# EAGLE design ChestStrapV2 (EAGLE 5.07)
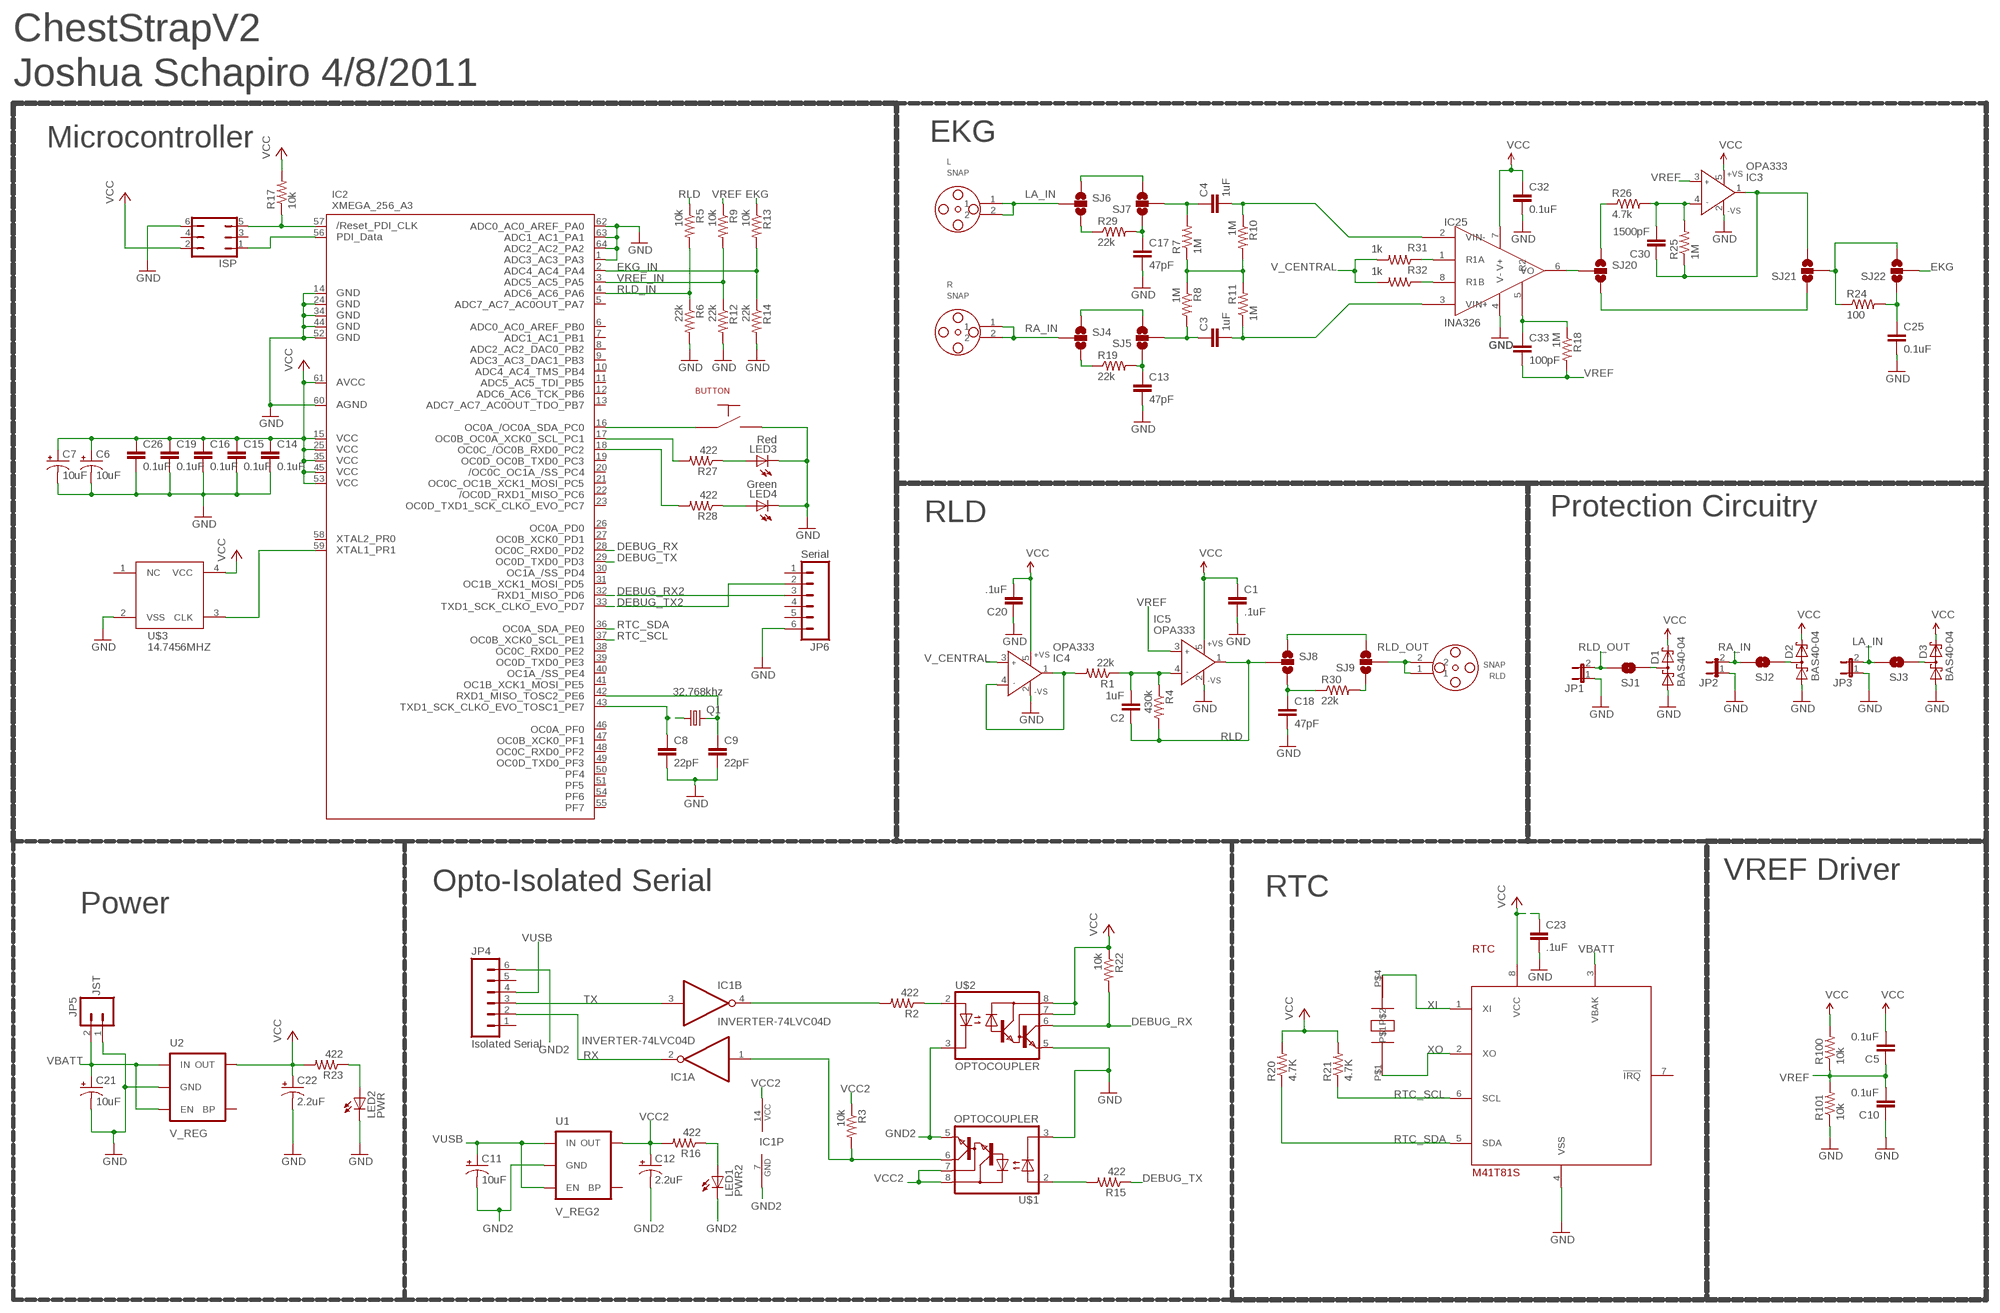
[diagram p0: schematic, sheet 1]

## Parts
BUTTON  BUTTON  [SMDBUTTON]
C1  .1uF  CAP0805  [0805]
C2  1uF  CAP0805  [0805]
C3  1uF  CAP0805  [0805]
C4  1uF  CAP0805  [0805]
C5  0.1uF  CAP0805  [0805]
C6  10uF  CAP_POL1206  [EIA3216]
C7  10uF  CAP_POL1206  [EIA3216]
C8  22pF  CAP0805  [0805]
C9  22pF  CAP0805  [0805]
C10  0.1uF  CAP0805  [0805]
C11  10uF  CAP_POL1206  [EIA3216]
C12  2.2uF  CAP_POL1206  [EIA3216]
C13  47pF  CAP0805  [0805]
C14  0.1uF  CAP0805  [0805]
C15  0.1uF  CAP0805  [0805]
C16  0.1uF  CAP0805  [0805]
C17  47pF  CAP0805  [0805]
C18  47pF  CAP0805  [0805]
C19  0.1uF  CAP0805  [0805]
C20  .1uF  CAP0805  [0805]
C21  10uF  CAP_POL1206  [EIA3216]
C22  2.2uF  CAP_POL1206  [EIA3216]
C23  .1uF  CAP0805  [0805]
C25  0.1uF  CAP0805  [0805]
C26  0.1uF  CAP0805  [0805]
C30  1500pF  CAP0805  [0805]
C32  0.1uF  CAP0805  [0805]
C33  100pF  CAP0805  [0805]
CRYSTAL  ECS_CRYSTAL  [ECS_CRYSTAL]
D1  BAS40-04  [SOT23]
D2  BAS40-04  [SOT23]
D3  BAS40-04  [SOT23]
IC1  INVERTER-74LVC04D  INVERTER-74ALS04D  [SO14]
IC2  XMEGA_256_A3  AVR_XMEGA_A3_  [TQFP64]
IC3  OPA333  AD8067  [SOT23-5]
IC4  OPA333  AD8067  [SOT23-5]
IC5  OPA333  AD8067  [SOT23-5]
IC25  INA326  [DGK_S-PDSO-G8]
ISP  JP3Q  [JP3Q]
JP1  JP1E  [JP1]
JP2  JP1E  [JP1]
JP3  JP1E  [JP1]
JP4  Isolated Serial  M06RA  [MOLEX-1X6-RA]
JP5  JST  M02JST-PTH-2  [JST-2-PTH]
JP6  Serial  M06RA  [MOLEX-1X6-RA]
L  SNAP  [SNAP]
LED1  PWR2  LEDCHIP-LED0805  [CHIP-LED0805]
LED2  PWR  LEDCHIP-LED0805  [CHIP-LED0805]
LED3  Red  LEDCHIP-LED0805  [CHIP-LED0805]
LED4  Green  LEDCHIP-LED0805  [CHIP-LED0805]
Q1  32.768khz  CRYSTAL32-SMD  [CRYSTAL-32KHZ-SMD]
R  SNAP  [SNAP]
R1  22k  RESISTOR  [0805]
R2  422  RESISTOR  [0805]
R3  10k  RESISTOR  [0805]
R4  430k  RESISTOR  [0805]
R5  10k  RESISTOR  [0805]
R6  22k  RESISTOR  [0805]
R7  1M  RESISTOR  [0805]
R8  1M  RESISTOR  [0805]
R9  10k  RESISTOR  [0805]
R10  1M  RESISTOR  [0805]
R11  1M  RESISTOR  [0805]
R12  22k  RESISTOR  [0805]
R13  10k  RESISTOR  [0805]
R14  22k  RESISTOR  [0805]
R15  422  RESISTOR  [0805]
R16  422  RESISTOR  [0805]
R17  10k  RESISTOR  [0805]
R18  1M  RESISTOR  [0805]
R19  22k  RESISTOR  [0805]
R20  4.7K  RESISTOR  [0805]
R21  4.7K  RESISTOR  [0805]
R22  10k  RESISTOR  [0805]
R23  422  RESISTOR  [0805]
R24  100  RESISTOR  [0805]
R25  1M  RESISTOR  [0805]
R26  4.7k  RESISTOR  [0805]
R27  422  RESISTOR  [0805]
R28  422  RESISTOR  [0805]
R29  22k  RESISTOR  [0805]
R30  22k  RESISTOR  [0805]
R31  1k  RESISTOR  [0805]
R32  1k  RESISTOR  [0805]
R100  10k  RESISTOR  [0805]
R101  10k  RESISTOR  [0805]
RLD  SNAP  [SNAP]
RTC  M41T81S  [SO08]
SJ1  SOLDERJUMPERNO  [SJ_2S-NO]
SJ2  SOLDERJUMPERNO  [SJ_2S-NO]
SJ3  SOLDERJUMPERNO  [SJ_2S-NO]
SJ4  R_EMI_EN  SOLDERJUMPER_2WAYS  [SJ_3]
SJ5  SOLDERJUMPER_2WAYS  [SJ_3]
SJ6  L_EMI_EN  SOLDERJUMPER_2WAYS  [SJ_3]
SJ7  SOLDERJUMPER_2WAYS  [SJ_3]
SJ8  SOLDERJUMPER_2WAYS  [SJ_3]
SJ9  SOLDERJUMPER_2WAYS  [SJ_3]
SJ20  AMP_EN  SOLDERJUMPER_2WAYS  [SJ_3]
SJ21  SOLDERJUMPER_2WAYS  [SJ_3]
SJ22  LP_EN  SOLDERJUMPER_2WAYS  [SJ_3]
U1  V_REG2  V_REG_LDOSMD  [SOT23-5]
U2  V_REG  V_REG_LDOSMD  [SOT23-5]
U$1  OPTOCOUPLER  [8-DIP_SMD]
U$2  OPTOCOUPLER  [8-DIP_SMD]
U$3  14.7456MHZ  16MHZ-OSC  [4-SMD]

## Nets
DEBUG_RX: IC2.28(PD2) R22.2 U$2.6(VO)
DEBUG_RX2: IC2.32(PD6) JP6.3
DEBUG_TX: IC2.29(PD3) R15.1
DEBUG_TX2: IC2.33(PD7) JP6.2
EKG: R13.1 SJ22.2
EKG_IN: IC2.2(PA4) R13.2 R14.1
GND: BUTTON.3 C1.2 C6.C(-) C7.C(-) C8.2 C9.2 C10.1 C13.2 C14.2 C15.2 C16.2 C17.2 C18.2 C19.2 C20.1 C21.C(-) C22.C(-) C23.2 C25.2 C26.2 C32.2 D1.1(A1) D2.1(A1) D3.1(A1) IC2.1(PA3) IC2.14(GND1) IC2.24(GND2) IC2.34(GND3) IC2.44(GND4) IC2.52(GND5) IC2.60(AGND) IC2.62(PA0) IC2.63(PA1) IC2.64(PA2) IC3.2(-VS) IC4.2(-VS) IC5.2(-VS) IC25.4(V-) ISP.6 JP1.1 JP2.1 JP3.1 JP5.1 JP6.6 LED2.C LED3.C LED4.C R6.2 R12.2 R14.2 R101.1 RTC.4(VSS) U2.2(GND) U$1.3(C) U$2.5(GND) U$3.2(VSS)
GND2: C11.C(-) C12.C(-) IC1.7(P:GND) JP4.6 LED1.C U1.2(GND) U$1.5(GND) U$2.3(C)
LA: C4.2 IC25.2(VIN-) R10.1
LA_IN: JP3.2 L.1 L.2 SJ3.2 SJ6.2
N$1: IC25.6(VO) SJ20.2
N$2: R26.1 SJ20.1
N$4: C9.1 IC2.42(PE6) Q1.X2
N$5: SJ20.3 SJ21.1
N$6: IC2.57(RESET) ISP.5 R17.1
N$7: IC2.56(PDI_DATA) ISP.1
N$8: C8.1 IC2.43(PE7) Q1.X1
N$9: IC2.59(PR1) U$3.3(CLK)
N$10: R24.1 SJ21.2 SJ22.3
N$11: C25.1 R24.2 SJ22.1
N$12: LED1.A R16.1
N$13: IC1.4(B:O) R2.2
N$14: R2.1 U$2.2(A)
N$15: C3.1 R8.2 SJ5.2
N$16: R19.1 SJ4.3
N$17: C13.1 R19.2 SJ5.1
N$18: IC25.1(R1A) R31.1
N$19: R29.1 SJ6.3
N$20: SJ4.1 SJ5.3
N$21: R15.2 U$1.2(A)
N$22: IC1.1(A:I) R3.2 U$1.6(VO)
N$23: LED2.A R23.1
N$24: IC2.17(PC1) R27.2
N$25: IC2.18(PC2) R28.2
N$26: R7.1 R8.1 R10.2 R11.2
N$27: BUTTON.1 IC2.16(PC0)
N$28: IC4.1(OUT) IC4.4(IN-) R1.2
N$29: D3.3(C1A2) SJ3.1
N$30: LED4.A R28.1
N$31: LED3.A R27.1
N$32: C4.1 R7.2 SJ7.2
N$33: C17.1 R29.2 SJ7.1
N$34: SJ6.1 SJ7.3
N$35: R30.2 SJ9.1
N$36: IC25.8(R1B) R32.1
N$37: C33.1 IC25.5(R2) R18.1
N$38: C2.2 IC5.4(IN-) R1.1 R4.1
N$39: SJ8.1 SJ9.3
N$40: D1.3(C1A2) SJ1.1
N$41: C18.1 R30.1 SJ8.3
N$42: D2.3(C1A2) SJ2.1
N$46: C30.2 IC3.4(IN-) R25.2 R26.2
N$49: C30.1 IC3.1(OUT) R25.1 SJ21.3
RA: C3.2 IC25.3(VIN+) R11.1
RA_IN: JP2.2 R.1 R.2 SJ2.2 SJ4.2
RLD: C2.1 IC5.1(OUT) R4.2 R5.1 SJ8.2
RLD_IN: IC2.4(PA6) R5.2 R6.1
RLD_OUT: JP1.2 RLD.1 RLD.2 SJ1.2 SJ9.2
RTC_SCL: IC2.37(PE1) R21.1 RTC.6(SCL)
RTC_SDA: IC2.36(PE0) R20.1 RTC.5(SDA)
RX: IC1.2(A:O) JP4.2
TX: IC1.3(B:I) JP4.3
V_CENTRAL: IC4.3(IN+) R31.2 R32.2
VBATT: C21.A(+) JP5.2 RTC.3(VBAK) U2.1(IN) U2.3(EN)
VCC: C1.1 C5.2 C6.A(+) C7.A(+) C14.1 C15.1 C16.1 C19.1 C20.2 C22.A(+) C23.1 C26.1 C32.1 D1.2(C2) D2.2(C2) D3.2(C2) IC2.15(VCC1) IC2.25(VCC2) IC2.35(VCC3) IC2.45(VCC4) IC2.53(VCC5) IC2.61(AVCC) IC3.5(+VS) IC4.5(+VS) IC5.5(+VS) IC25.7(V+) ISP.2 R17.2 R20.2 R21.2 R22.1 R23.2 R100.2 RTC.8(VCC) U2.5(OUT) U$2.7(VB) U$2.8(VCC) U$3.4(VCC)
VCC2: C12.A(+) IC1.14(P:VCC) R3.1 R16.2 U1.5(OUT) U$1.7(VB) U$1.8(VCC)
VREF: C5.1 C10.2 C33.2 IC3.3(IN+) IC5.3(IN+) R9.1 R18.2 R100.1 R101.2
VREF_IN: IC2.3(PA5) R9.2 R12.1
VUSB: C11.A(+) JP4.4 U1.1(IN) U1.3(EN)
XI: CRYSTAL.P$4 RTC.1(XI)
XO: CRYSTAL.P$1 RTC.2(XO)
Unconnected: IC1.5(C:I) IC1.6(C:O) IC1.8(D:O) IC1.9(D:I) IC1.10(E:O) IC1.11(E:I) IC1.12(F:O) IC1.13(F:I) IC2.5(PA7) IC2.6(PB0) IC2.7(PB1) IC2.8(PB2) IC2.9(PB3) IC2.10(PB4) IC2.11(PB5) IC2.12(PB6) IC2.13(PB7) IC2.19(PC3) IC2.20(PC4) IC2.21(PC5) IC2.22(PC6) IC2.23(PC7) IC2.26(PD0) IC2.27(PD1) IC2.30(PD4) IC2.31(PD5) IC2.38(PE2) IC2.39(PE3) IC2.40(PE4) IC2.41(PE5) IC2.46(PF0) IC2.47(PF1) IC2.48(PF2) IC2.49(PF3) IC2.50(PF4) IC2.51(PF5) IC2.54(PF6) IC2.55(PF7) IC2.58(PR0) ISP.3 ISP.4 JP4.1 JP4.5 JP6.1 JP6.4 JP6.5 RTC.7(!IRQ) U1.4(BP) U2.4(BP) U$3.1(NC)

## Notes on the sheet
- ChestStrapV2
- Joshua Schapiro 4/8/2011
- Microcontroller | EKG
- RLD | Protection Circuitry
- VREF Driver
- Opto-Isolated Serial | RTC
- Power

## Library data of the parts
BUTTON = GadgetOne:BUTTON: A simple button, see http://search.digikey.com/scripts/DkSearch/dksus.dll?Detail&name=EG1868CT-ND
C1-C5 C8-C10 C13-C20 C23 C25 C26 C30 C32 C33 = SparkFun:CAP: Capacitor Standard 0603 ceramic capacitor, and 0.1" leaded capacitor.
C6 C7 C11 C12 C21 C22 = SparkFun:CAP_POL: Capacitor Polarized These are standard SMD and PTH capacitors. Normally 10uF, 47uF, and 100uF in electrolytic and tantalum varieties. Always verify the external diameter of the through hole cap, it varies with capacity, voltage, and manufacturer. The EIA devices should be standard.
CRYSTAL = BATT_CHARGE:ECS_CRYSTAL
D1-D3 = diode:BAS40-04: Silicon Schottky Diodes General-purpose diode for high-speed switching
IC1 = gadgetry:INVERTER-74*04: Hex INVERTER
IC2 = xmega:AVR_XMEGA_A3_: Device for Atmel AVR XMEGA A3 Series
IC3-IC5 = analog-devices:AD8067: High Gain Bandwidth, Precision Fast FET(TM) Op Amp Source: http://www.analog.com/UploadedFiles/Data_Sheets/346131962AD8067_a.pdf
IC25 = mpocius:INA326
ISP = jumper:JP3Q: JUMPER
JP1-JP3 = jumper:JP1E: JUMPER
JP4 JP6 = SparkFun:M06: Header 6 Standard 6-pin 0.1" header. Use with straight break away headers (SKU : PRT-00116), right angle break away headers (PRT-00553), swiss pins (PRT-00743), machine pins (PRT-00117), and female headers (PRT-00115). Molex polarized connector foot print use with SKU : PRT-08094 with associated crimp pins and housings. NOTES ON THE VARIANTS LOCK and LOCK_LONGPADS... This footprint was designed to help hold the alignment of a through-hole component (i.e. 6-pin header) while soldering it into place. You may notice that each hole has been shifted either up or down by 0.005 of an inch from it's more standard position (which is a perfectly straight line). This slight alteration caused the pins (the squares in the middle) to touch the edges of the holes. Because they are alternating, it causes a "brace" to hold the component in place. 0.005 has proven to be the perfect amount of "off-center" position when using our standard breakaway headers. Although looks a little odd when you look at the bare footprint, once you have a header in there, the alteration is very hard to notice. Also, if you push a header all the way into place, it is covered up entirely on the bottom side. This idea of altering the position of holes to aid alignment will be further integrated into the Sparkfun Library for other footprints. It can help hold any component with 3 or more connection pins.
JP5 = SparkFun:M02: Header 2 Standard 2-pin 0.1" header. Use with straight break away headers (SKU : PRT-00116), right angle break away headers (PRT-00553), swiss pins (PRT-00743), machine pins (PRT-00117), and female headers (PRT-00115). Molex polarized connector foot print use with SKU : PRT-08233 with associated crimp pins and housings.
L R RLD = Josh:SNAP
LED1-LED4 = led:LED: LED OSRAM: - CHIPLED LG R971, LG N971, LY N971, LG Q971, LY Q971, LO R971, LY R971 LH N974, LH R974 LS Q976, LO Q976, LY Q976 LO Q996 - Hyper CHIPLED LW Q18S LB Q993, LB Q99A, LB R99A - SideLED LS A670, LO A670, LY A670, LG A670, LP A670 LB A673, LV A673, LT A673, LW A673 LH A674 LY A675 LS A676, LA A676, LO A676, LY A676, LW A676 LS A679, LY A679, LG A679 - Hyper Micro SIDELED® LS Y876, LA Y876, LO Y876, LY Y876 LT Y87S - SmartLED LW L88C, LW L88S LB L89C, LB L89S, LG L890 LS L89K, LO L89K, LY L89K LS L896, LA L896, LO L896, LY L896 - TOPLED LS T670, LO T670, LY T670, LG T670, LP T670 LSG T670, LSP T670, LSY T670, LOP T670, LYG T670 LG T671, LOG T671, LSG T671 LB T673, LV T673, LT T673, LW T673 LH T674 LS T676, LA T676, LO T676, LY T676, LB T676, LH T676, LSB T676, LW T676 LB T67C, LV T67C, LT T67C, LS T67K, LO T67K, LY T67K, LW E67C LS E67B, LA E67B, LO E67B, LY E67B, LB E67C, LV E67C, LT E67C LW T67C LS T679, LY T679, LG T679 LS T770, LO T770, LY T770, LG T770, LP T770 LB T773, LV T773, LT T773, LW T773 LH T774 LS E675, LA E675, LY E675, LS T675 LS T776, LA T776, LO T776, LY T776, LB T776 LHGB T686 LT T68C, LB T68C - Hyper Mini TOPLED® LB M676 - Mini TOPLED Santana® LG M470 LS M47K, LO M47K, LY M47K Source: http://www.osram.convergy.de LUXEON: - LUMILED® LXK2-PW12-R00, LXK2-PW12-S00, LXK2-PW14-U00, LXK2-PW14-V00 LXK2-PM12-R00, LXK2-PM12-S00, LXK2-PM14-U00 LXK2-PE12-Q00, LXK2-PE12-R00, LXK2-PE12-S00, LXK2-PE14-T00, LXK2-PE14-U00 LXK2-PB12-K00, LXK2-PB12-L00, LXK2-PB12-M00, LXK2-PB14-N00, LXK2-PB14-P00, LXK2-PB14-Q00 LXK2-PR12-L00, LXK2-PR12-M00, LXK2-PR14-Q00, LXK2-PR14-R00 LXK2-PD12-Q00, LXK2-PD12-R00, LXK2-PD12-S00 LXK2-PH12-R00, LXK2-PH12-S00 LXK2-PL12-P00, LXK2-PL12-Q00, LXK2-PL12-R00 Source: www.luxeon.com KINGBRIGHT: KA-3528ASYC Source: www.kingbright.com
Q1 = SparkFun:CRYSTAL: Crystals Various standard crystals. Proven footprints. Spark Fun Electronics SKU : COM-00534
R1-R32 R100 R101 = SparkFun:RESISTOR: Resistor Basic schematic elements and footprints for 0603, 1206, and PTH 1/10th watt (small) resistors.
RTC = BATT_CHARGE:M41T81S
SJ1-SJ3 = SparkFun:SOLDERJUMPER: Solder Jumper Standard SMD solder jumper. Used to automate production. Two varients : Normally Open and Normally Closed are the same, but have different paste layers. NC will have a large amount of paste and should jumper during reflow.
SJ4-SJ9 SJ20-SJ22 = SparkFun:SOLDERJUMPER_2WAY: Solder Jumper 2 way solder jumper
U1 U2 = SparkFun:V_REG_LDO: Voltage Regulator LDO Standard 150mA LDO voltage regulator in SOT-23 layout. Micrel part MIC5205. BP (by-pass) pin is used to lower output noise with 470pF cap.
U$1 U$2 = Josh:OPTOCOUPLER
U$3 = Josh:16MHZ-OSC

## Board
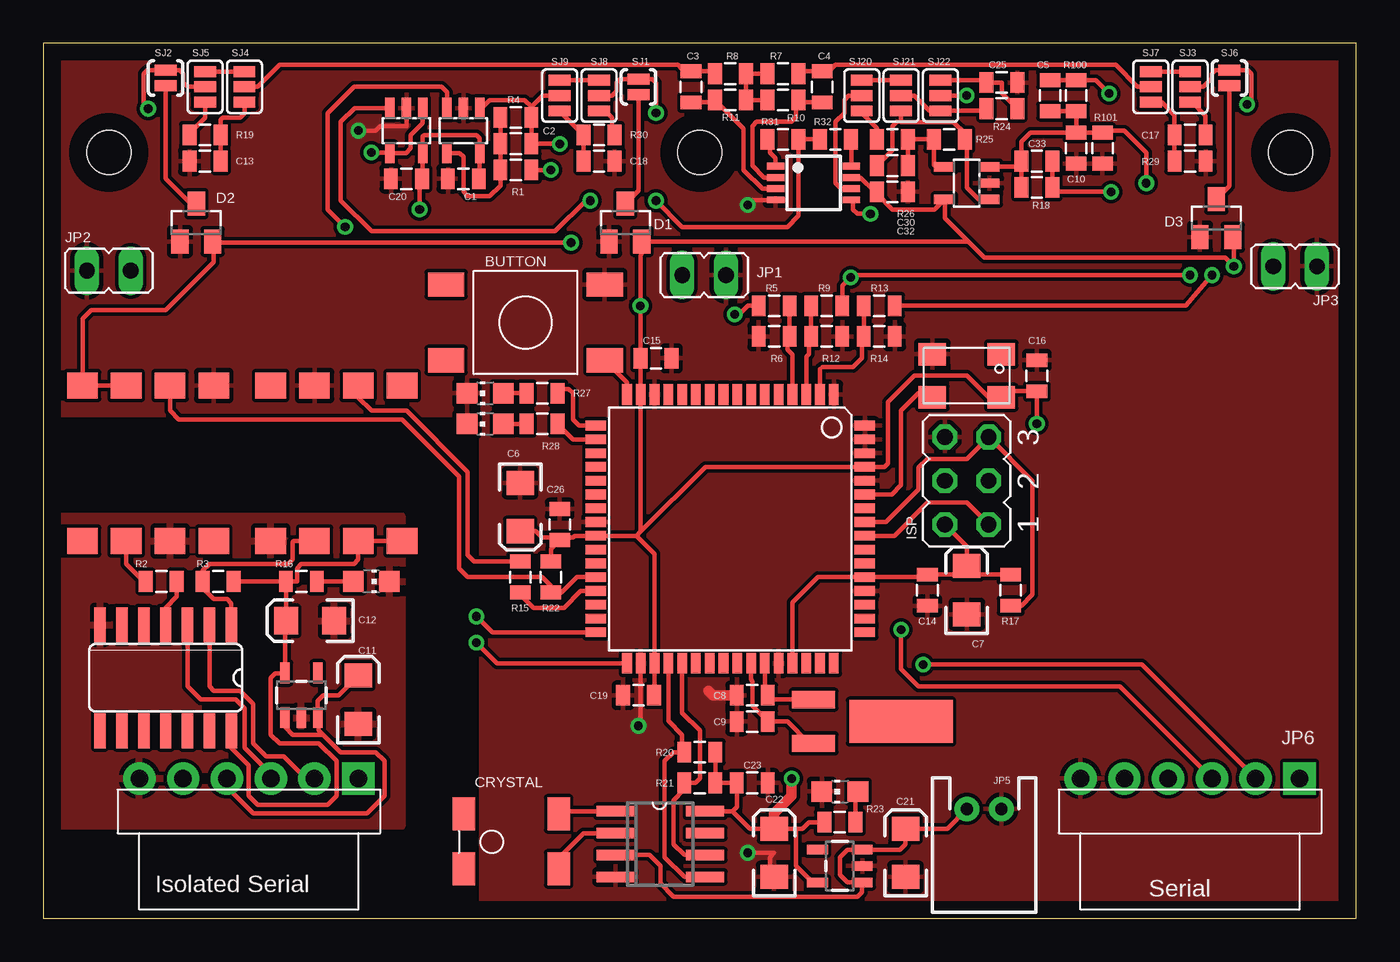
[diagram p1: board, top side]
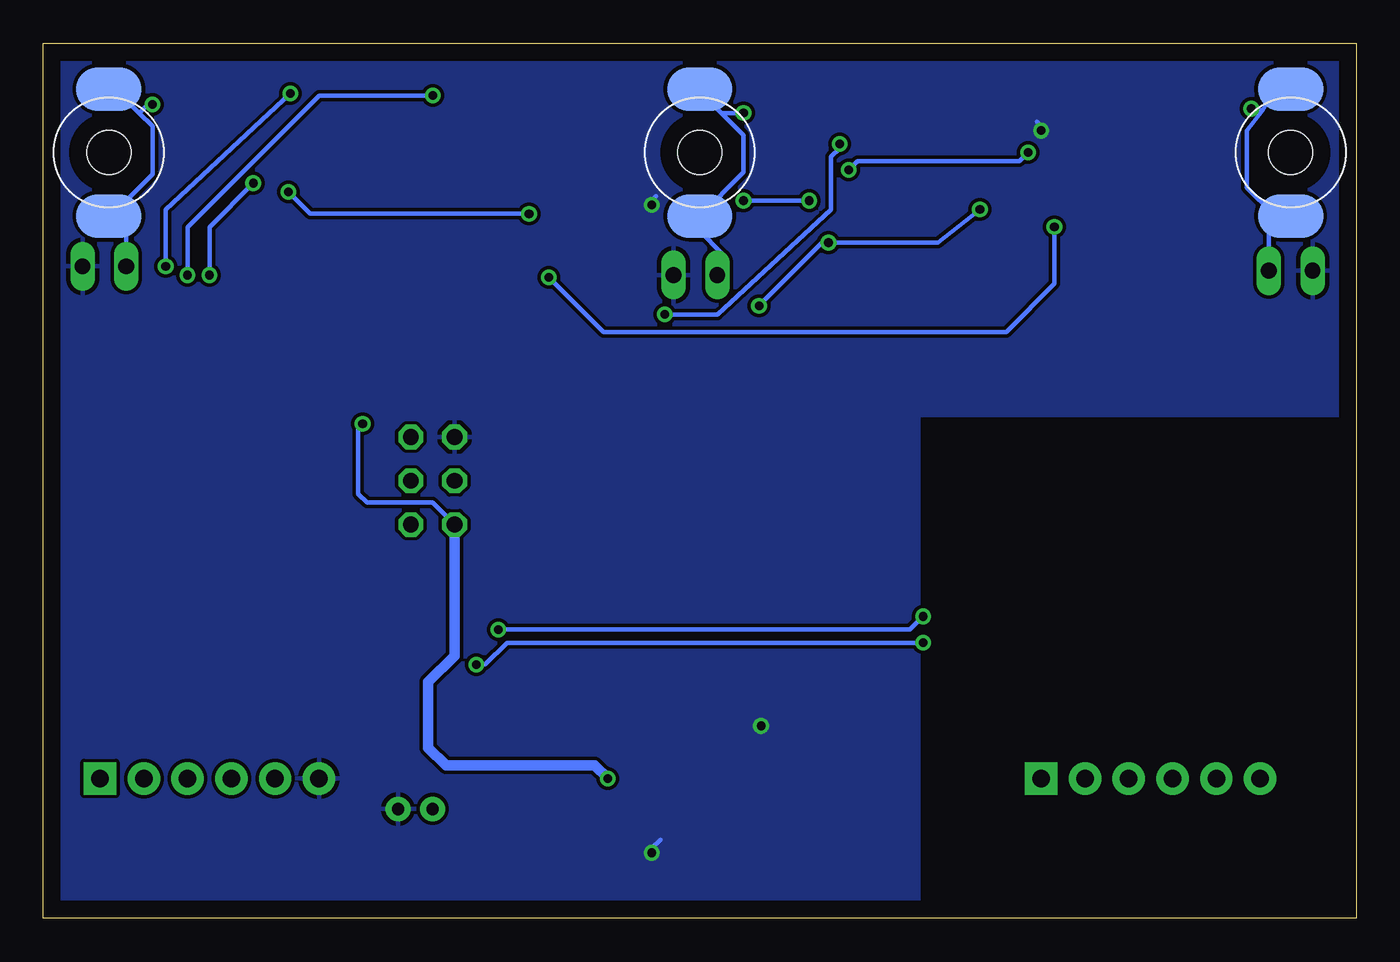
[diagram p2: board, bottom side, seen from below]

Size 76.2 x 50.8 mm. Coordinates in mm from the lower left corner, seen from the top.
Outline: 0,0 76.2,0 76.2,50.8 0,50.8 0,0
Copper layers (1*16): Top 0.035mm / dielectric 1.5mm / Bottom 0.035mm
Design rules "default *": minimum track width 10mil, minimum drill 5mil, track to track 8mil, track to pad 8mil, pad to pad 8mil, via to via 8mil, smd to smd 8mil, copper to edge 40mil, drill to drill 8mil, minimum pad ring 10mil, minimum via ring 8mil, stop-mask expansion 4mil, vias tented up to drill 0mil, thermal gap 10mil

### Footprints (pad centres in the part's own frame; a part is rotated, then mirrored left to right if it is on the bottom)
SMDBUTTON = smd 2.1 x 1.4: 1 -1.6,5.2; 2 7.6,5.2; 3 -1.6,0.8; 4 7.6,0.8
0805 = smd 0.8 x 1.2: 1 -0.9,0; 2 0.9,0
EIA3216 = smd 1.4 x 1.6: A 1.4,0; C -1.4,0
ECS_CRYSTAL = smd 1.3 x 1.9: P$1 -0.7,2.2; P$2 4.8,2.2; P$3 4.8,-1; P$4 -0.7,-1
SOT23 = smd 1 x 1.4: 1 -0.95,-1.1; 2 0.95,-1.1; 3 0,1.1
SO14 = smd 0.66 x 2.032: 1 -3.81,-3.073; 2 -2.54,-3.073; 3 -1.27,-3.073; 4 0,-3.073; 5 1.27,-3.073; 6 2.54,-3.073; 7 3.81,-3.073; 8 3.81,3.073; 9 2.54,3.073; 10 1.27,3.073; 11 0,3.073; 12 -1.27,3.073; 13 -2.54,3.073; 14 -3.81,3.073
TQFP64 = smd 1.194 x 0.559: 1 -7.8,6; 2 -7.8,5.2; 3 -7.8,4.4; 4 -7.8,3.6; 5 -7.8,2.8; 6 -7.8,2; 7 -7.8,1.2; 8 -7.8,0.4; 9 -7.8,-0.4; 10 -7.8,-1.2; 11 -7.8,-2; 12 -7.8,-2.8; 13 -7.8,-3.6; 14 -7.8,-4.4; 15 -7.8,-5.2; 16 -7.8,-6; 33 7.8,-6; 34 7.8,-5.2; 35 7.8,-4.4; 36 7.8,-3.6; 37 7.8,-2.8; 38 7.8,-2; 39 7.8,-1.2; 40 7.8,-0.4; 41 7.8,0.4; 42 7.8,1.2; 43 7.8,2; 44 7.8,2.8; 45 7.8,3.6; 46 7.8,4.4; 47 7.8,5.2; 48 7.8,6 | smd 0.559 x 1.194: 17 -6,-7.8; 18 -5.2,-7.8; 19 -4.4,-7.8; 20 -3.6,-7.8; 21 -2.8,-7.8; 22 -2,-7.8; 23 -1.2,-7.8; 24 -0.4,-7.8; 25 0.4,-7.8; 26 1.2,-7.8; 27 2,-7.8; 28 2.8,-7.8; 29 3.6,-7.8; 30 4.4,-7.8; 31 5.2,-7.8; 32 6,-7.8; 49 6,7.8; 50 5.2,7.8; 51 4.4,7.8; 52 3.6,7.8; 53 2.8,7.8; 54 2,7.8; 55 1.2,7.8; 56 0.4,7.8; 57 -0.4,7.8; 58 -1.2,7.8; 59 -2,7.8; 60 -2.8,7.8; 61 -3.6,7.8; 62 -4.4,7.8; 63 -5.2,7.8; 64 -6,7.8
SOT23-5 = smd 0.55 x 1.2: 1 -0.95,-1.3; 2 0,-1.3; 3 0.95,-1.3; 4 0.95,1.3; 5 -0.95,1.3
DGK_S-PDSO-G8 = smd 0.4 x 1: 1 -0.975,-2.2; 2 -0.325,-2.2; 3 0.325,-2.2; 4 0.975,-2.2; 5 0.975,2.2; 6 0.325,2.2; 7 -0.325,2.2; 8 -0.975,2.2
JP3Q = drill 0.914 octagon: 1 -2.54,-1.27; 2 -2.54,1.27; 3 0,-1.27; 4 0,1.27; 5 2.54,-1.27; 6 2.54,1.27
JP1 = drill 0.914 long: 1 0,-1.27; 2 0,1.27
MOLEX-1X6-RA = drill 1.016 pad 1.88 square: 1 0,0 | drill 1.016 pad 1.88 round: 2 2.54,0; 3 5.08,0; 4 7.62,0; 5 10.16,0; 6 12.7,0
JST-2-PTH = drill 0.7 pad 1.448 round: 1 -1,0; 2 1,0
SNAP = smd 2.54 x 3.81: 1 -3.683,0; 2 3.683,0 | hole 2.54: 0,0
CHIP-LED0805 = smd 1.2 x 1.2: A 0,-1.05; C 0,1.05
CRYSTAL-32KHZ-SMD = smd 2.5 x 6: SHEILD 0,5.08 | smd 1 x 2.5: X1 -1.27,0; X2 1.27,0
SO08 = smd 0.6 x 2.2: 1 -1.905,-2.6; 2 -0.635,-2.6; 3 0.635,-2.6; 4 1.905,-2.6; 5 1.905,2.6; 6 0.635,2.6; 7 -0.635,2.6; 8 -1.905,2.6
SJ_2S-NO = smd 0.635 x 1.27: 1 -0.45,0; 2 0.45,0
SJ_3 = smd 0.635 x 1.27: 1 -0.889,0; 2 0,0; 3 0.889,0
8-DIP_SMD = smd 1.778 x 1.524: 1 3.81,4.508; 2 1.27,4.508; 3 -1.27,4.508; 4 -3.81,4.508; 5 -3.81,-4.508; 6 -1.27,-4.508; 7 1.27,-4.508; 8 3.81,-4.508
4-SMD = smd 1.6 x 1.3: 1 -2,-1.25; 2 2,-1.25; 3 2,1.25; 4 -2,1.25

### Placement (x,y rotation side)
BUTTON  30.99,37.59 180 top
C1  24.38,42.93 180 top
C2  27.43,46.48 180 top
C3  37.59,48.26 270 top
C4  45.21,48.26 270 top
C5  58.42,47.75 90 top
C6  27.69,23.88 270 top
C7  53.59,19.05 90 top
C8  41.15,12.95 180 top
C9  41.15,11.43 180 top
C10  59.94,44.7 90 top
C11  18.29,12.7 90 top
C12  15.49,17.27 180 top
C13  9.4,43.94 180 top
C14  51.31,19.05 270 top
C15  35.56,32.51 0 top
C16  57.66,31.5 90 top
C17  66.55,43.94 0 top
C18  32.26,43.94 0 top
C19  34.54,12.95 180 top
C20  21.08,42.93 0 top
C21  50.04,3.81 90 top
C22  42.42,3.81 90 top
C23  41.15,7.87 0 top
C25  55.63,48.51 0 top
C26  29.97,22.86 90 top
C30  49.28,43.69 0 top
C32  49.28,42.16 0 top
C33  57.66,43.94 180 top
CRYSTAL  29.21,5.08 180 top
D1  33.78,40.39 0 top
D2  8.89,40.39 0 top
D3  68.07,40.64 0 top
IC1  7.11,13.97 180 top
IC2  39.88,22.61 270 top
IC3  53.59,42.67 90 top
IC4  21.08,45.72 180 top
IC5  24.38,45.72 180 top
IC25  44.7,42.67 270 top
ISP  53.59,25.4 90 top
JP1  38.35,37.34 90 top
JP2  3.81,37.59 270 top
JP3  72.64,37.85 90 top
JP4  18.29,8.13 180 top
JP5  54.61,6.35 180 top
JP6  72.9,8.13 180 top
L  72.39,44.45 90 bottom
LED1  19.05,19.56 270 top
LED2  46.23,7.37 90 top
LED3  25.65,30.48 90 top
LED4  25.65,28.7 90 top
Q1  44.7,11.43 270 top
R  3.81,44.45 90 bottom
R1  27.43,43.43 0 top
R2  6.86,19.56 0 top
R3  10.16,19.56 180 top
R4  27.43,44.96 0 top
R5  42.42,35.56 0 top
R6  42.42,33.78 180 top
R7  42.93,49.02 0 top
R8  39.88,49.02 180 top
R9  45.47,35.56 180 top
R10  42.93,47.5 180 top
R11  39.88,47.5 0 top
R12  45.47,33.78 0 top
R13  48.51,35.56 180 top
R14  48.51,33.78 0 top
R15  27.69,19.81 90 top
R16  14.99,19.56 180 top
R17  56.13,19.05 90 top
R18  57.66,42.42 180 top
R19  9.4,45.47 0 top
R20  38.1,9.65 0 top
R21  38.1,7.87 0 top
R22  29.46,19.81 270 top
R23  46.23,5.59 180 top
R24  55.63,46.99 0 top
R25  52.58,45.21 180 top
R26  49.28,45.21 0 top
R27  28.96,30.48 0 top
R28  28.96,28.7 0 top
R29  66.55,45.47 180 top
R30  32.26,45.47 0 top
R31  42.93,45.21 0 top
R32  45.97,45.21 180 top
R100  59.94,47.75 90 top
R101  61.47,44.7 90 top
RLD  38.1,44.45 90 bottom
RTC  35.81,4.32 270 top
SJ1  34.54,48.26 90 top
SJ2  7.11,48.77 90 top
SJ3  68.83,48.77 90 top
SJ4  9.4,48.26 270 top
SJ5  11.68,48.26 90 top
SJ6  66.55,48.26 270 top
SJ7  64.26,48.26 90 top
SJ8  29.97,47.75 270 top
SJ9  32.26,47.75 90 top
SJ20  47.5,47.75 90 top
SJ21  49.78,47.75 270 top
SJ22  52.07,47.75 270 top
U1  14.99,12.95 0 top
U2  46.23,3.05 90 top
U$1  17.02,26.42 0 top
U$2  6.1,26.42 180 top
U$3  53.59,31.5 180 top

### Tracks (layer width: path | path; a pad name or v marks a point on that pad's centre or on a via)
DEBUG_RX
  Top 0.254: IC2.28 30.98,19.81 30.09,18.91 R22.2 29.46,19.3 28.96,19.81 24.64,19.81 24.13,20.32 24.13,25.65 20.83,28.96 7.87,28.96 7.37,29.46 U$2.6
DEBUG_RX2  (via drill 0.5)
  Top 0.254: IC2.32 26.07,16.61 v25.15,17.53 | v49.78,16.76 49.78,14.48 50.8,13.46 62.48,13.46 JP6.3
  Bottom 0.254: v25.15,17.53 25.91,16.76 v49.78,16.76
DEBUG_TX
  Top 0.254: IC2.29 31.2,19.01 30.23,18.03 28.45,18.03 27.94,18.54 27.94,18.66 R15.1
DEBUG_TX2  (via drill 0.5)
  Top 0.254: IC2.33 26.34,14.81 v25.15,16 | v51.05,14.73 63.75,14.73 JP6.2
  Bottom 0.254: v25.15,16 49.28,16 50.55,14.73 v51.05,14.73
EKG  (via drill 0.5)
  Top 0.254: R13.1 66.29,35.56 v67.82,37.34 | v53.59,47.75 SJ22.2
  Bottom 0.254: v67.82,37.34 67.82,40.13 60.2,47.75 v53.59,47.75
EKG_IN
  Top 0.254: IC2.2 45.08,31.87 45.21,32 46.99,32 47.5,32.51 47.5,33.67 R14.1 R13.2
GND  (via drill 0.5)
  Top 0.254: IC2.34 34.68,11.31 v34.54,11.18 | C22.C 42.29,2.41 42.16,2.54 42.16,3.56 42.42,3.81 v40.89,3.81 | IC4.2 21.08,45.97 19.56,45.97 19.3,45.72 v18.29,45.72 | IC25.4 41.19,41.7 v40.89,41.4
  Top 0.61: C8.2 38.86,12.95 38.61,13.21
  Bottom 0.254: v34.54,11.18 34.29,11.18 | v40.89,3.81 40.89,4.06 40.39,4.57 | v18.29,45.72 18.29,45.97 18.54,46.23 | v40.89,41.4 40.89,41.66 40.64,41.91
  pour Top: 0,50.8 76.2,50.8 76.2,0 25.4,0 25.4,29.21 0,29.21
  pour Bottom: 76.2,0 76.2,50.8 0,50.8 0,29.21 25.4,29.21 25.4,0
GND2
  pour Top: 0,23.37 20.83,23.37 20.83,5.33 0,5.33
LA
  Top 0.254: C4.2 43.96,47.36 R10.1 43.69,47.36 43.69,46.48 43.43,46.23 41.4,46.23 41.15,45.97 41.15,43.69 41.84,43 IC25.2
LA_IN  (via drill 0.5)
  Top 0.254: SJ6.2 67.31,48.26 67.82,48.77 67.82,49.02 68.01,49.22 SJ3.2 69.91,49.22 70.1,49.02 70.1,47.5 v69.85,47.24
  Bottom 0.254: L.2 72.26,48.01 71.88,48.01 70.61,46.74 | 70.61,46.74 69.85,45.97 69.85,43.18 71.63,41.4 71.75,41.4 L.1 71.37,39.75 JP3.2 | v69.85,47.24 70.1,47.24 70.61,46.74
N$1
  Top 0.254: IC25.6 46.3,42.35 45.97,42.67 45.97,46.23 46.48,46.74 46.48,47.5 46.74,47.75 SJ20.2
N$2
  Top 0.254: SJ20.1 47.5,46.74 48.38,45.86 R26.1
N$4
  Top 0.254: Q1.X2 44.45,10.16 43.18,11.43 C9.1 41.15,12.33 41.15,13.72 41.08,13.9 IC2.42
N$5
  Top 0.254: SJ20.3 SJ21.1
N$6
  Top 0.254: IC2.57 48.91,23.01 50.8,24.89 50.8,26.16 51.31,26.67 53.59,26.67 ISP.5 57.4,25.4 57.4,18.8 56.76,18.15 R17.1
N$7
  Top 0.254: IC2.56 49.38,22.21 51.31,24.13 53.59,24.13 ISP.1
N$8
  Top 0.254: IC2.43 41.88,13.04 C8.1 42.05,12.7 Q1.X1
N$9
  Top 0.254: IC2.59 49.24,24.61 49.78,25.15 49.78,29.46 50.8,30.48 51.36,30.48 U$3.3
N$10
  Top 0.254: SJ21.2 50.55,47.75 51.44,46.86 SJ22.3 54.85,46.86 R24.1
N$11
  Top 0.254: SJ22.1 54.85,48.64 C25.1 55.63,48.51 55.63,47.89 R24.2
N$12
  Top 0.254: R16.1 LED1.A
N$13
  Top 0.254: IC1.4 7.11,18.03 7.76,18.68 R2.2
N$14
  Top 0.254: U$2.2 4.83,20.57 5.84,19.56 R2.1
N$15
  Top 0.254: SJ5.2 12.45,48.26 13.72,49.53 36.83,49.53 37.08,49.28 37.48,49.28 C3.1 38.84,49.16 R8.2
N$16
  Top 0.254: R19.1 8.5,45.58 9.4,46.48 SJ4.3
N$17
  Top 0.254: SJ5.1 11.68,46.74 11.43,46.48 10.41,46.48 10.3,46.37 R19.2 C13.1
N$18
  Top 0.254: IC25.1 42.5,44.11 42.16,44.45 42.16,45.07 R31.1
N$19
  Top 0.254: SJ6.3 66.67,47.37 67.45,46.6 R29.1
N$20
  Top 0.254: SJ4.1 SJ5.3
N$21
  Top 0.254: R15.2 25.01,20.71 24.64,21.08 24.64,25.91 21.08,29.46 19.05,29.46 18.29,30.23 U$1.2
N$22
  Top 0.254: IC1.1 10.92,18.29 10.67,18.54 9.91,18.54 9.26,19.19 R3.2 9.26,20.18 9.65,20.57 14.22,20.57 14.48,20.83 14.48,21.84 14.54,21.91 U$1.6
N$23
  Top 0.254: R23.1 47.13,7.22 LED2.A
N$24
  Top 0.254: IC2.17 31.08,28.61 30.73,28.96 30.73,30.48 30.48,30.73 30.11,30.73 R27.2
N$25
  Top 0.254: IC2.18 30.75,27.81 R28.2
N$26
  Top 0.254: R7.1 R8.1 R11.2 R10.2
N$27
  Top 0.254: IC2.16 33.88,31.1 BUTTON.1
N$28  (via drill 0.5)
  Top 0.254: IC4.1 22.03,46.16 21.34,45.47 21.34,44.7 21.05,44.42 IC4.4 20.1,44.45 v19.05,44.45 | v29.46,43.43 R1.2
  Bottom 0.254: v29.46,43.43 28.96,43.94 19.56,43.94 v19.05,44.45
N$29
  Top 0.254: SJ3.1 68.83,42.5 D3.3
N$30
  Top 0.254: LED4.A R28.1
N$31
  Top 0.254: LED3.A R27.1
N$32
  Top 0.254: R7.2 43.96,49.16 C4.1 45.6,49.16 45.97,49.53 62.23,49.53 63.5,48.26 SJ7.2
N$33
  Top 0.254: SJ7.1 64.9,47.37 65.65,46.62 R29.2 C17.1
N$34
  Top 0.254: SJ7.3 SJ6.1
N$35
  Top 0.254: SJ9.1 32.64,46.86 33.02,46.48 33.02,45.6 R30.2
N$36
  Top 0.254: IC25.8 46.9,45.18 R32.1
N$37  (via drill 0.5)
  Top 0.254: C33.1 R18.1 58.81,42.16 v61.98,42.16 | v48.01,40.89 47.24,40.89 46.99,41.15 46.99,41.61 IC25.5
  Bottom 0.254: v48.01,40.89 60.71,40.89 v61.98,42.16
N$38
  Top 0.254: C2.2 R4.1 R1.1 26.53,42.53 25.91,41.91 24.64,41.91 24.38,42.16 24.38,44.2 24.16,44.42 IC5.4
N$39
  Top 0.254: SJ8.1 SJ9.3
N$40
  Top 0.254: D1.3 34.54,42.25 SJ1.1
N$41
  Top 0.254: C18.1 R30.1 SJ8.3
N$42
  Top 0.254: SJ2.1 7.11,42.93 8.55,41.49 D2.3
N$46
  Top 0.254: C30.2 R26.2 R25.2 51.68,43.73 IC3.4
N$49
  Top 0.254: 49.78,46.2 49.53,46.23 49.28,45.97 49.28,44.59 C30.1 | 49.78,46.2 52.83,46.2 53.48,45.58 R25.1 53.59,45.1 53.59,42.42 54.29,41.72 IC3.1 | 49.78,46.2 SJ21.3
RA
  Top 0.254: C3.2 38.84,47.36 R11.1 40.64,45.84 40.64,43.43 41.73,42.35 IC25.3
RA_IN  (via drill 0.5)
  Top 0.254: SJ4.2 8.38,48.26 8.13,48.51 8.13,49.02 7.93,49.22 SJ2.2 6.04,49.22 5.84,49.02 5.84,47.24 v6.1,46.99
  Bottom 0.254: R.2 4.7,48.13 5.46,46.86 | 5.46,46.86 6.35,45.72 6.35,42.42 4.83,40.89 3.94,40.89 R.1 4.19,40.77 5.08,39.88 JP2.2 | v6.1,46.99 5.84,46.99 5.46,46.86
RLD  (via drill 0.5)
  Top 0.254: IC5.1 25.43,47.02 25.91,47.5 27.94,47.5 28.33,47.11 | 28.33,47.11 C2.1 R4.2 v29.97,44.96 | v40.13,35.05 40.39,35.05 40.89,35.56 R5.1 | SJ8.2 28.98,47.75 28.33,47.11
  Bottom 0.254: v29.97,44.96 29.97,44.7 30.48,44.2 30.48,41.15 37.08,35.05 v40.13,35.05
RLD_IN
  Top 0.254: IC2.4 43.48,32.72 43.18,33.02 43.18,33.64 R6.1 R5.2
RLD_OUT  (via drill 0.5)
  Top 0.254: SJ9.2 33.02,47.75 33.27,48.01 33.27,48.51 33.47,48.71 SJ1.2 35.36,48.71 35.56,48.51 v35.56,46.74
  Bottom 0.254: RLD.2 37.72,47.62 36.83,46.74 | 36.83,46.74 35.56,45.47 35.56,43.31 RLD.1 38.1,39.88 36.83,38.61 36.83,37.59 JP1.2 | 36.83,46.74 v35.56,46.74
RTC_SCL
  Top 0.254: RTC.6 37.21,3.68 36.58,4.32 36.58,6.86 37.2,7.48 R21.1 37.85,7.87 38.1,8.13 38.1,10.92 37.08,11.94 IC2.37
RTC_SDA
  Top 0.254: RTC.5 37.21,2.41 36.07,3.56 36.07,9.14 36.58,9.65 R20.1 37.08,9.77 37.08,10.67 36.28,11.47 IC2.36
RX
  Top 0.254: JP4.2 15.24,8.13 13.97,9.4 12.95,9.4 12.19,10.16 12.19,12.45 11.43,13.21 9.91,13.21 9.65,13.46 IC1.2
TX
  Top 0.254: JP4.3 13.21,8.38 11.68,9.91 11.68,12.19 11.18,12.7 9.14,12.7 8.38,13.46 IC1.3
V_CENTRAL  (via drill 0.5)
  Top 0.254: R32.2 R31.2 43.83,40.78 43.18,40.13 37.08,40.13 v35.56,41.66 | IC4.3 18.06,47.02 17.27,46.23 17.27,41.66 19.05,39.88 29.72,39.88 31.5,41.66 v31.75,41.66
  Bottom 0.254: v31.75,41.66 v35.56,41.66
VBATT
  Top 0.254: JP5.2 52.47,5.21 C21.A 50.04,4.32 49.72,4 U2.3 46.67,4 46.23,3.56 46.23,2.54 46.67,2.1 U2.1 47.5,2.07 47.5,1.52 47.24,1.27 36.58,1.27 35.81,2.03 35.81,3.05 35.18,3.68 RTC.3
VCC  (via drill 0.5)
  Top 0.254: C1.1 25.33,42.98 IC5.5 25.33,45.28 25.15,45.47 22.1,45.47 22.03,45.4 IC4.5 22.03,42.98 C20.2 21.84,42.79 v21.84,41.15 | U$2.7 U$2.8 2.29,34.8 2.79,35.31 7.11,35.31 9.91,38.1 9.91,39.22 | 9.91,39.22 D2.2 | 43.69,5.21 C22.A 41.02,5.21 40.01,6.22 | 43.69,5.21 44.07,5.21 44.45,5.59 R23.2 | U2.5 44.64,2.1 43.69,3.05 43.69,5.21 | 40.01,6.22 RTC.8 | 40.01,6.22 40.25,6.47 C23.1 R21.2 R20.2 | IC25.7 47.43,43 48.26,42.16 C32.1 48.38,42.05 49.28,41.15 51.72,41.15 IC3.5 52.32,41.69 52.32,40.64 53.68,39.29 | 53.68,39.29 D1.2 34.73,38.54 34.66,38.47 v34.66,35.56 C15.1 34.68,32.49 IC2.15 34.68,22.45 | 53.68,39.29 54.61,38.35 68.58,38.35 v69.09,37.85 69.09,39.47 D3.2 | 9.91,39.22 v30.63,39.22 | C5.2 R100.2 61.08,48.65 v61.85,47.88 | C19.1 35.48,12.99 IC2.35 35.48,21.16 34.44,22.21 | 34.44,22.21 IC2.25 30.84,22.21 30.73,22.1 30.11,22.1 C26.1 | IC2.45 43.48,18.33 44.95,19.81 IC2.53 51.16,19.81 C14.1 53.09,19.95 C7.A | 34.68,22.45 34.44,22.21 | R17.2 54.09,19.95 C7.A | ISP.2 53.59,21.59 C7.A | 34.68,22.45 38.44,26.21 IC2.61 48.81,26.21 49.02,26.42 49.02,29.97 50.55,31.5 53.59,31.5 54.84,30.25 U$3.4 55.94,30.6 C16.1 v57.66,28.7 | C6.A 28.58,22.48 28.96,22.1 29.83,22.1 C26.1 | R22.1 29.46,21.45 C26.1
  Top 0.61: v43.43,8.13 43.43,7.11 42.42,6.1 C22.A
  Bottom 0.254: v21.84,41.15 24.28,39.22 v30.63,39.22 31,39.22 v34.66,35.56 | v69.09,37.85 69.09,41.15 v61.85,47.88 | ISP.2 53.59,24.13 57.4,24.13 57.91,24.64 57.91,28.45 v57.66,28.7
  Bottom 0.61: ISP.2 52.32,15.24 53.85,13.72 53.85,9.91 52.83,8.89 44.2,8.89 v43.43,8.13
VCC2
  Top 0.254: U$1.8 U$1.7 18.29,20.83 18.03,20.57 14.99,20.57 14.73,20.32 14.73,19.56 R16.2 | IC1.14 10.92,9.91 11.94,8.89 11.94,7.11 12.45,6.6 16.51,6.6 17.02,7.11 17.02,9.14 16,10.16 13.72,10.16 13.21,10.67 13.21,13.97 13.46,14.22 14.01,14.22 U1.5 14.04,17.21 C12.A R16.2 | R16.2 R3.1
VREF  (via drill 0.5)
  Top 0.254: C33.2 R18.2 | IC3.3 56.44,43.62 C33.2 | C5.1 R100.1 C10.2 | C33.2 56.76,45.07 57.29,45.6 C10.2 | C10.2 R101.2 61.58,45.72 62.74,45.72 64.01,44.45 v64.01,42.67 | R9.1 46.37,36.71 v46.86,37.21 46.99,37.34 v66.55,37.34 | IC5.3 23.43,47.94 23.11,48.26 18.03,48.26 16.51,46.74 16.51,41.15 v17.53,40.13
  Bottom 0.254: v66.55,37.34 66.55,40.13 v64.01,42.67 | v17.53,40.13 17.53,36.83 20.32,34.04 43.69,34.04 v46.86,37.21
VREF_IN
  Top 0.254: IC2.3 44.28,32.59 44.45,32.77 44.45,33.67 R12.1 R9.2
VUSB
  Top 0.254: C11.A 17.14,12.95 16.26,12.95 15.94,12.63 U1.3 16,11.59 16,10.92 16.26,10.67 | U1.1 14.04,11.11 14.48,10.67 16.26,10.67 | JP4.4 10.67,7.62 12.19,6.1 18.8,6.1 19.81,7.11 19.81,9.14 19.3,9.65 17.27,9.65 16.26,10.67
XI
  Top 0.254: RTC.1 30.05,6.22 CRYSTAL.P$4
XO
  Top 0.254: RTC.2 31.37,4.95 29.91,3.49 CRYSTAL.P$1

### Text on the board
Reference: R | L | RLD | ChestStrap V2 | Joshua Schapiro | 04/08/2011